# EAGLE design reverb2 (EAGLE 9.5.2)
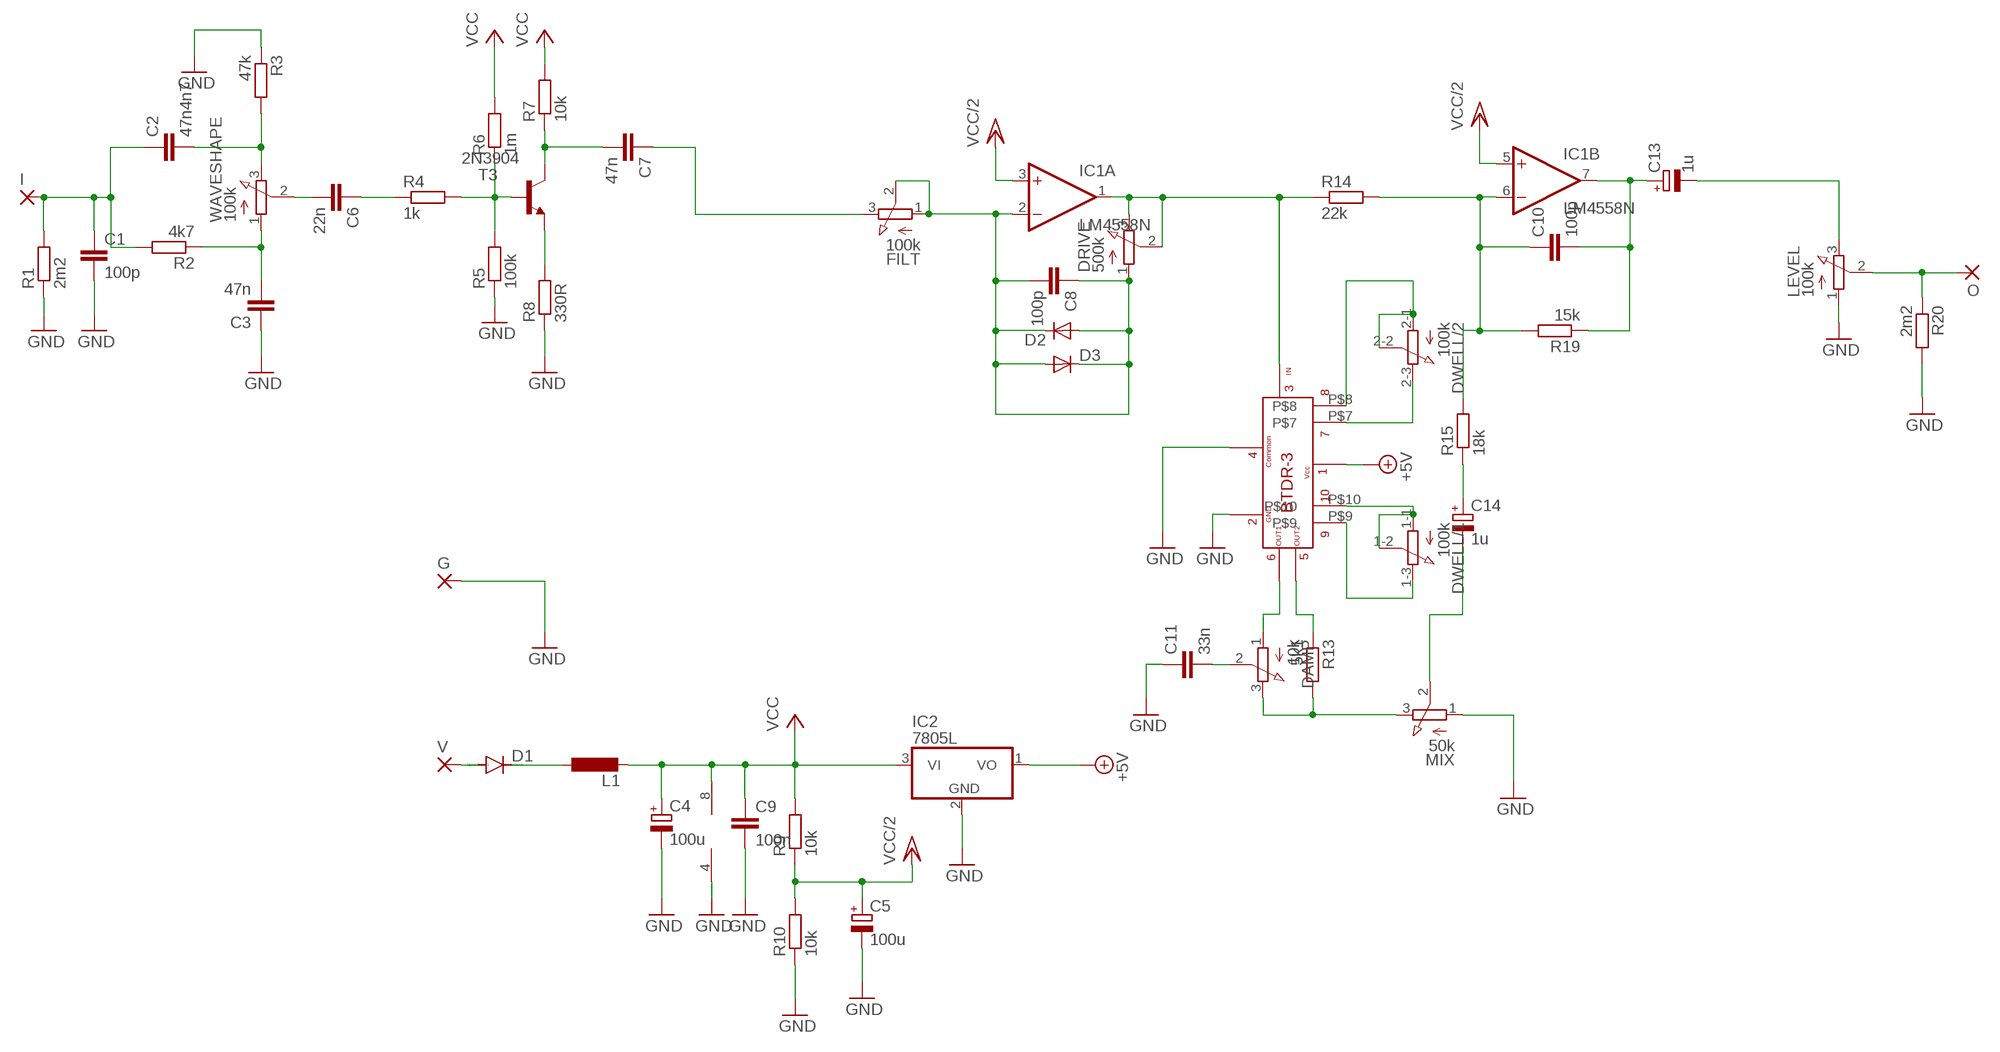
[diagram p0: schematic, sheet 1]

## Parts
C1  100p  C5/2.5  [S5MMHEXCAP]
C2  47n4n7  C5/2.5  [S5MMHEXCAP]
C3  47n  C5/2.5  [S5MMHEXCAP]
C4  100u  CPOL-EUE2.5-7  [E2,5-7]
C5  100u  CPOL-EUE2.5-7  [E2,5-7]
C6  22n  C5/2.5  [S5MMHEXCAP]
C7  47n  C5/2.5  [S5MMHEXCAP]
C8  100p  C5/2.5  [S5MMHEXCAP]
C9  100n  C5/2.5  [S5MMHEXCAP]
C10  100p  C5/2.5  [S5MMHEXCAP]
C11  33n  C5/2.5  [S5MMHEXCAP]
C13  1u  CPOL-EUE2-4  [E2-4]
C14  1u  CPOL-EUE2-4  [E2-4]
D1  1N4148DO35-7  [DO35-7]
D2  SMALL_DIODEDO35-7  [DO35-7]
D3  SMALL_DIODEDO35-7  [DO35-7]
DAMP  10k  HEXPOT1  [3RP/1610N]
DRIVE  500k  HEXPOT1  [3RP/1610N]
DWELL  100k  3RP/1610G  [3RP/1610G]
FILT  100k  HEXPOT1  [3RP/1610N]
G  WIREPAD1,6/0,9  [1,6/0,9]
I  WIREPAD1,6/0,9  [1,6/0,9]
IC1  LM4558N  [DIL08]
IC2  7805L  [TO92]
L1  L-EU0204/7  [0204/7]
LEVEL  100k  HEXPOT1  [3RP/1610N]
MIX  50k  HEXPOT1  [3RP/1610N]
O  WIREPAD1,6/0,9  [1,6/0,9]
R1  2m2  R-EU_0207/7  [0207/7]
R2  4k7  R-EU_0207/7  [0207/7]
R3  47k  R-EU_0207/7  [0207/7]
R4  1k  R-EU_0207/7  [0207/7]
R5  100k  R-EU_0207/7  [0207/7]
R6  1m  R-EU_0207/7  [0207/7]
R7  10k  R-EU_0207/7  [0207/7]
R8  330R  R-EU_0207/7  [0207/7]
R9  10k  R-EU_0207/7  [0207/7]
R10  10k  R-EU_0207/7  [0207/7]
R13  5k1  R-EU_0207/7  [0207/7]
R14  22k  R-EU_0207/7  [0207/7]
R15  18k  R-EU_0207/7  [0207/7]
R19  15k  R-EU_0207/7  [0207/7]
R20  2m2  R-EU_0207/7  [0207/7]
T3  2N3904  [TO92]
U$2  BTDR-3  [BTDR3]
V  WIREPAD1,6/0,9  [1,6/0,9]
WAVESHAPE  100k  HEXPOT1  [3RP/1610N]

## Nets
+5V: IC2.1(VO) U$2.P$1
GND: C1.2 C3.1 C4.- C5.- C9.2 C11.1 G.1(P) IC1.4(P:V-) IC2.2(GND) LEVEL.1(A) MIX.1(A) R1.1 R3.1 R5.1 R8.1 R10.1 R20.2 U$2.P$2 U$2.P$4
N$1: R4.2 R5.2 R6.1 T3.2(B)
N$2: C7.2 R7.1 T3.1(C)
N$3: DWELL.2-3(/2:E) U$2.P$7
N$4: R13.1 U$2.P$5
N$5: DAMP.1(A) U$2.P$6
N$6: C7.1 FILT.3(E)
N$7: DAMP.3(E) MIX.3(E) R13.2
N$8: D1.C L1.1
N$9: C2.2 R3.2 WAVESHAPE.3(E)
N$10: C13.- LEVEL.3(E)
N$11: C14.- MIX.2(S)
N$12: C11.2 DAMP.2(S)
N$13: C10.1 IC1.6(B:-IN) R14.2 R15.2 R19.2
N$14: C14.+ R15.1
N$15: C6.1 R4.1
N$16: C8.1 C8.2 D2.A D2.C D3.A D3.C DRIVE.1(A) FILT.1(A) FILT.2(S) IC1.2(A:-IN)
N$17: C3.2 R2.1 WAVESHAPE.1(A)
N$18: R8.2 T3.3(E)
N$19: C1.1 C2.1 I.1(P) R1.2 R2.2
N$20: C6.2 WAVESHAPE.2(S)
N$21: LEVEL.2(S) O.1(P) R20.1
N$22: D1.A V.1(P)
N$23: DRIVE.2(S) DRIVE.3(E) IC1.1(A:OUT) R14.1 U$2.P$3
N$24: C10.2 C13.+ IC1.7(B:OUT) R19.1
N$25: DWELL.2-1(/2:A) DWELL.2-2(/2:S) U$2.P$8
N$26: DWELL.1-3(/1:E) U$2.P$9
N$27: DWELL.1-1(/1:A) DWELL.1-2(/1:S) U$2.P$10
VCC: C4.+ C9.1 IC1.8(P:V+) IC2.3(VI) L1.2 R6.2 R7.2 R9.2
VCC/2: C5.+ IC1.3(A:+IN) IC1.5(B:+IN) R9.1 R10.2

## Library data of the parts
C1-C3 C6-C11 = hexcapacitor-wima:C: CAPACITOR naming: grid - package width
C4 C5 C13 C14 = hexresistor:CPOL-EU: POLARIZED CAPACITOR, European symbol; SPICEPREFIX: C
D1 = diode:1N4148: DIODE high speed (Philips)
D2 D3 = backside power header 10pin:SMALL_DIODE: Small Signal Diode
DAMP DRIVE FILT LEVEL MIX WAVESHAPE = hexpedalpot:HEXPOT1: 16mm Potentiometer one level Source: http://www.alphapotentiometers.net/html/16mm_pot_2.html
DWELL = hexpedalpot:3RP/1610G: 16mm Potentiometer two level Source: http://www.alphapotentiometers.net/html/16mm_pot_2.html
G I O V = wirepad:WIREPAD: Wire PAD connect wire on PCB
IC1 = linear:*4558: OP AMP
IC2 = linear:78*: Positive VOLTAGE REGULATOR Source: http://cache.national.com/ds/LM/LM78L05.pdf http://www.fairchildsemi.com/ds/LM/LM7805.pdf
L1 = hexresistor:L-EU: INDUCTOR, European symbol; SPICEPREFIX: L
R1-R10 R13-R15 R19 R20 = hexresistor:R-EU_: RESISTOR, European symbol; SPICEPREFIX: R
T3 = transistor:2N3904: NPN TRANSISTOR
U$2 = BTDR3:BTDR-3

## Net classes
0 default: width 0.356 mm

## Board
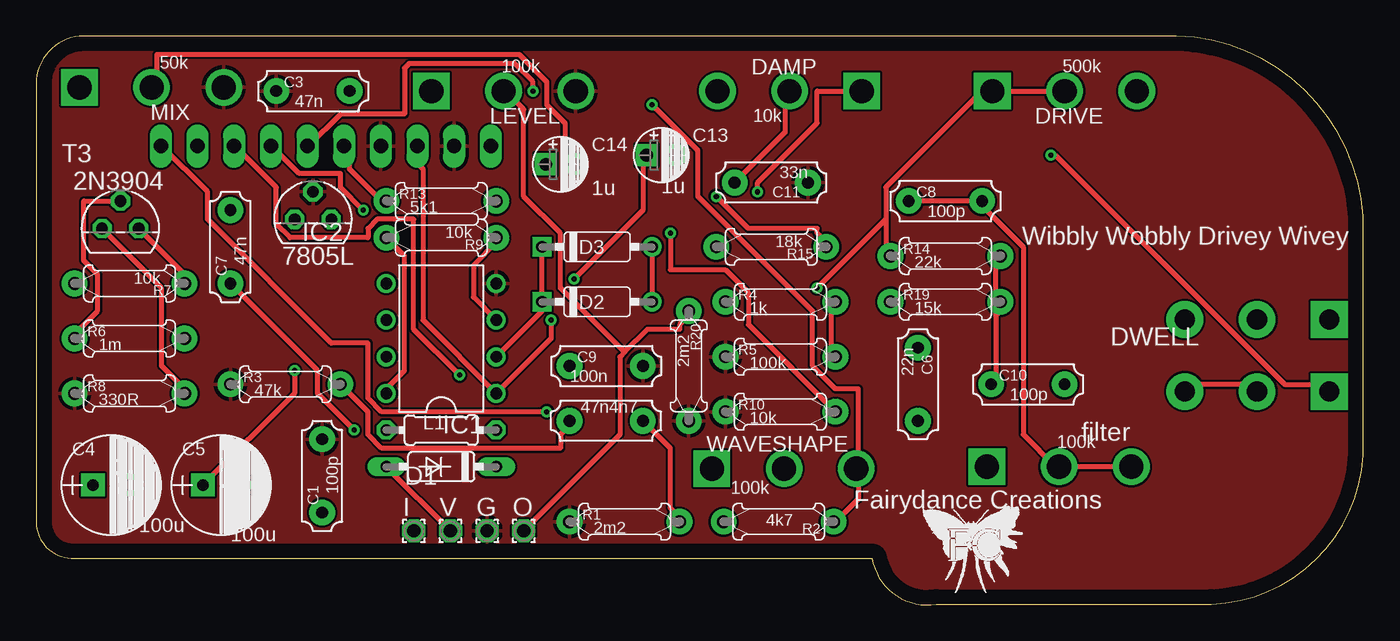
[diagram p1: board, top side]
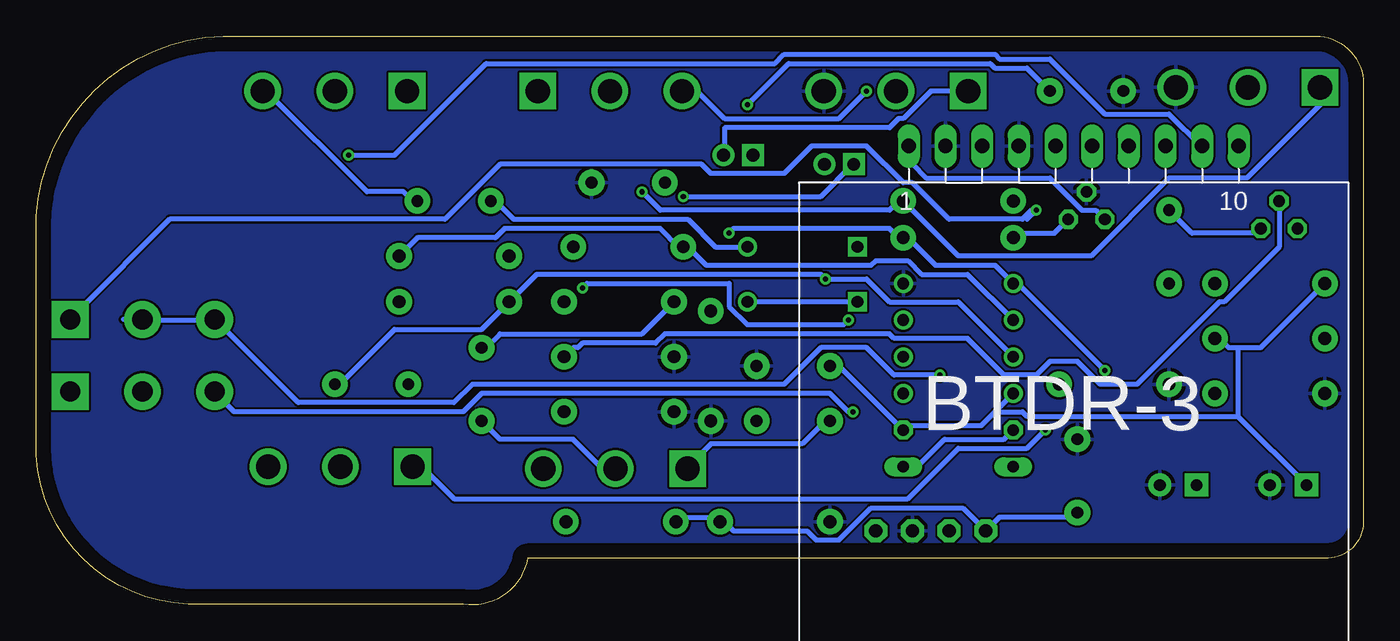
[diagram p2: board, bottom side, seen from below]

Size 91.95 x 39.42 mm. Coordinates in mm from the lower left corner, seen from the top.
Outline: 0,36.12 0,5.64 arc90 2.67,3.23 57.91,3.23 arc90 62.36,0.05 81.41,0.05 arc90 91.95,11.35 91.95,25.71 arc90 78.99,39.42 3.3,39.42 arc90 0,36.12
Copper layers (1*16): Top 0.035mm / dielectric 1.5mm / Bottom 0.035mm
Design rules "default": minimum track width 6mil, minimum drill 0.35mm, track to track 6mil, track to pad 6mil, pad to pad 6mil, via to via 6mil, smd to smd 6mil, copper to edge 40mil, drill to drill 6mil, minimum pad ring 10mil, minimum via ring 8mil, stop-mask expansion 4mil, vias tented up to drill 0mil, thermal gap 10mil

### Footprints (pad centres in the part's own frame; a part is rotated, then mirrored left to right if it is on the bottom)
S5MMHEXCAP = drill 0.813 pad 1.778: 1 -2.54,0; 2 2.54,0
E2,5-7 = drill 0.813 pad 1.6 square: + -1.27,0 | drill 0.813 pad 1.6: - 1.27,0
E2-4 = drill 0.889 pad 1.524 square: + -1.016,0 | drill 0.889 pad 1.524: - 1.016,0
DO35-7 = drill 0.813 long: A 3.81,0; C -3.81,0
DO35-7' = drill 0.813: A 3.81,0 | drill 0.813 square: C -3.81,0
3RP/1610N = drill 1.676 pad 2.54: 1 -5,0; 2 0,0 | drill 1.676 pad 2.54 square: 3 5,0
3RP/1610G = drill 1.397 pad 2.54: 1-1 -5,0; 1-2 0,0; 2-1 -5,5; 2-2 0,5 | drill 1.397 pad 2.54 square: 1-3 5,0; 2-3 5,5
1,6/0,9 = drill 0.914 pad 1.6 octagon: 1 0,0
DIL08 = drill 0.813 pad 1.27: 1 -3.81,-3.81; 2 -1.27,-3.81; 3 1.27,-3.81; 4 3.81,-3.81; 5 3.81,3.81; 6 1.27,3.81; 7 -1.27,3.81; 8 -3.81,3.81
TO92 = drill 0.813 octagon: 1 -1.27,0; 2 0,1.905; 3 1.27,0
0204/7 = drill 0.813 octagon: 1 -3.81,0; 2 3.81,0
0207/7 = drill 0.889 pad 1.778: 1 -3.81,0; 2 3.81,0
TO92' = drill 0.813 octagon: 1 1.27,0; 2 0,1.905; 3 -1.27,0
BTDR3 = drill 1 long: P$1 11.43,-9.525; P$2 8.89,-9.525; P$3 6.35,-9.525; P$4 3.81,-9.525; P$5 1.27,-9.525; P$6 -1.27,-9.525; P$7 -3.81,-9.525; P$8 -6.35,-9.525; P$9 -8.89,-9.525; P$10 -11.43,-9.525

### Placement (x,y rotation side)
C1  19.81,8.94 90 top
C2  39.5,12.75 180 top
C3  19.18,35.61 0 top
C4  5.21,8.31 0 top
C5  12.83,8.31 0 top
C6  61.09,15.29 270 top
C7  13.46,24.82 90 top
C8  62.99,27.99 0 top
C9  39.5,16.56 0 top
C10  68.71,15.29 0 top
C11  50.93,29.26 180 top
C13  43.31,31.17 0 top
C14  36.32,30.53 0 top
D1  28.07,9.58 180 top
D2  [DO35-7']  38.86,21.01 0 top
D3  [DO35-7']  38.86,24.82 0 top
DAMP  52.2,35.61 0 top
DRIVE  71.25,35.61 180 top
DWELL  84.58,14.78 0 top
FILT  70.87,9.58 180 top
G  31.24,5.13 0 top
I  26.16,5.13 0 top
IC1  28.07,18.47 90 top
IC2  19.18,26.72 0 top
L1  28.07,12.12 0 top
LEVEL  32.39,35.61 180 top
MIX  8,35.87 180 top
O  33.78,5.13 0 top
R1  40.77,5.77 0 top
R2  51.44,5.77 180 top
R3  17.27,15.29 0 top
R4  51.56,21.01 0 top
R5  51.56,17.2 0 top
R6  6.48,18.47 0 top
R7  6.48,22.28 180 top
R8  6.48,14.66 0 top
R9  28.07,25.45 180 top
R10  51.56,13.39 0 top
R13  28.07,27.99 0 top
R14  62.99,24.18 0 top
R15  50.93,24.82 180 top
R19  62.99,21.01 0 top
R20  45.21,16.56 270 top
T3  2N3904  [TO92']  5.84,26.09 0 top
U$2  20.07,22.28 180 bottom
V  28.7,5.13 0 top
WAVESHAPE  51.82,9.45 180 top

### Tracks (layer width: path | path; a pad name or v marks a point on that pad's centre or on a via)
+5V
  Bottom 0.356: IC2.1 18.54,27.36 19.49,27.36 21.72,29.58 30.29,29.58 31.24,30.53 31.24,31.8 U$2.P$1
GND
  pour Bottom: 0.76,36.88 0.76,5.77 arc90 7.11,-0.58 88.01,-0.58 arc90 102.17,13.58 arc90 74.42,41.33 5.21,41.33 arc90
  pour Top: 0.76,37.04 0.76,5.13 arc90 7.11,-1.22 82.04,-1.22 arc90 104.9,21.64 arc90 85.85,40.69 3.68,40.69 arc90
N$1
  Top 0.356: R5.2 55.05,17.51 55.05,20.69 R4.2 | T3.2 3.3,27.99 3.3,23.86 4.25,22.91 4.25,20.37 2.67,18.78 R6.1
  Bottom 0.356: R5.2 54.74,17.83 54.42,17.83 54.1,18.15 49.02,18.15 48.39,18.78 32.83,18.78 32.51,18.47 27.43,18.47 24.89,15.93 22.67,15.93 21.72,16.88 19.81,16.88 18.22,15.29 15.68,15.29 9.97,21.01 9.65,21.01 5.84,24.82 T3.2
N$2
  Top 0.356: T3.1 10.29,22.91 R7.1
  Bottom 0.356: C7.2 11.88,25.77 7.43,25.77 T3.1
N$3  (via drill 0.35)
  Top 0.356: v22.67,27.36 21.08,28.94 21.08,29.9 18.22,29.9 16.32,31.8 U$2.P$7
  Bottom 0.356: 23.3,26.72 v22.67,27.36 22.99,27.36 23.62,26.72 28.7,26.72 31.24,29.26 31.88,29.26 34.42,31.8 38.23,31.8 40.13,29.9 45.21,29.9 45.85,30.53 59.82,30.53 63.63,26.72 82.68,26.72 89.03,20.37 DWELL.2-3
N$4
  Top 0.356: R13.1 23.94,27.99 21.72,30.21 21.72,31.48 21.4,31.8 U$2.P$5
N$5  (via drill 0.35)
  Top 0.356: v34.42,35.61 34.42,36.25 33.15,37.52 25.84,37.52 25.53,37.2 25.53,34.02 21.08,34.02 18.86,31.8 U$2.P$6
  Bottom 0.356: v34.42,35.61 36.32,33.71 44.26,33.71 46.16,35.61 DAMP.1
N$6  (via drill 0.35)
  Top 0.356: C7.1 19.49,16.24 19.49,14.66 v22.03,12.12
  Bottom 0.356: v22.03,12.12 23.3,10.85 28.07,10.85 31.56,7.35 62.99,7.35 65.21,9.58 FILT.3
N$7  (via drill 0.35)
  Top 0.356: DAMP.3 54.1,35.61 54.1,33.39 49.97,29.26 v49.97,28.63
  Bottom 0.356: MIX.3 2.98,35.61 2.98,34.66 8.06,29.58 13.46,29.58 18.86,24.18 28.07,24.18 R13.2 32.2,27.99 32.83,27.36 48.71,27.36 v49.97,28.63
N$8
  Bottom 0.356: L1.1 24.89,11.48 29.02,11.48 30.92,9.58 D1.C
N$9
  Top 0.356: R3.2 22.99,13.39 22.99,11.8 23.94,10.85 36.32,10.85 36.32,11.8 36.96,12.43 C2.2
  Bottom 0.356: C2.2 37.28,12.75 38.86,11.16 45.21,11.16 46.8,9.58 WAVESHAPE.3
N$10
  Bottom 0.356: LEVEL.3 29.97,35.61 31.88,33.71 32.2,33.71 32.83,33.07 44.26,33.07 44.26,31.17 C13.-
N$11
  Top 0.356: MIX.2 8.38,36.25 8.38,38.15 33.46,38.15 35.37,36.25 35.37,34.66 36.64,33.39 36.64,31.17 37.28,30.53 C14.-
N$12
  Top 0.356: C11.2 51.88,32.75 51.88,35.29 DAMP.2
N$13
  Top 0.356: C10.1 66.48,15.61 66.48,20.05 | 66.48,20.05 66.8,20.37 R19.2 | R14.2 66.48,23.86 66.48,20.05
  Bottom 0.356: IC1.6 27.43,22.91 30.61,22.91 31.56,23.86 33.78,23.86 34.1,23.55 45.53,23.55 46.8,24.82 R15.2 47.43,24.82 48.71,26.09 59.5,26.09 60.14,25.45 65.53,25.45 R14.2
N$14  (via drill 0.35)
  Top 0.356: v47.12,28.31 49.34,26.09 54.1,26.09 54.1,25.77 54.74,25.13 R15.1
  Bottom 0.356: v47.12,28.31 37.59,28.31 35.37,30.53 C14.+
N$15
  Bottom 0.356: R4.1 49.97,18.78 59.82,18.78 60.77,17.83 C6.1
N$16
  Top 0.356: D3.A D2.A | IC1.2 35.05,20.37 D2.C D3.C | FILT.1 FILT.2 70.61,9.58 68.39,11.8 68.39,24.82 65.53,27.67 C8.2 C8.1
  Bottom 0.356: D2.C D2.A | C8.2 65.85,27.99 66.48,28.63 69.02,28.63 76.01,35.61 DRIVE.1 | D3.A 44.89,24.82 46.8,26.72 58.86,26.72 60.14,27.99 C8.1
N$17  (via drill 0.35)
  Top 0.356: v42.67,34.66 45.85,31.48 45.85,28.31 53.78,20.37 53.78,16.56 55.37,14.97 56.96,14.97 56.96,9.58 WAVESHAPE.1 56.96,9.26 56.96,7.35 55.37,5.77 R2.1
  Bottom 0.356: C3.2 23.3,37.2 25.53,37.2 25.84,37.52 39.82,37.52 v42.67,34.66
N$18
  Top 0.356: T3.3 8.7,21.96 8.7,16.56 10.29,14.97 R8.2
N$19
  Top 0.356: C2.1 43.94,10.85 43.94,6.72 44.58,6.08 R1.2
  Bottom 0.356: C1.1 20.13,6.08 25.21,6.08 I.1 27.75,6.72 34.1,6.72 36.32,4.5 37.91,4.5 38.54,5.13 43.62,5.13 44.26,5.77 R1.2 44.89,6.08 47.12,6.08 47.43,5.77 R2.2
N$20
  Bottom 0.356: C6.2 59.82,11.48 54.74,11.48 52.83,9.58 51.88,9.58 WAVESHAPE.2
N$21
  Top 0.356: O.1 40.45,11.8 40.45,17.2 40.77,17.51 | 40.77,17.51 42.35,19.1 44.58,19.1 44.58,19.42 45.21,20.05 R20.1 | 40.77,17.51 36.32,21.96 36.32,25.77 33.78,28.31 33.78,34.34 32.51,35.61 LEVEL.2
N$22
  Top 0.356: V.1 D1.A
N$23  (via drill 0.35)
  Top 0.356: U$2.P$3 26.48,31.8 26.48,30.53 26.8,30.21 26.8,19.74 IC1.1 35.69,18.47 v35.69,19.74 | R14.1 58.86,24.5 58.86,26.72 | 58.86,26.72 58.86,28.94 65.53,35.61 DRIVE.3 DRIVE.2 | 58.86,26.72 v54.1,21.96
  Bottom 0.356: v35.69,19.74 36,19.42 42.67,19.42 43.94,20.69 43.94,22.28 53.78,22.28 v54.1,21.96
N$24  (via drill 0.35)
  Top 0.356: v37.28,22.59 42.04,27.36 42.04,31.17 C13.+
  Bottom 0.356: C10.2 70.93,15.29 67.12,19.1 61.09,19.1 R19.1 57.28,22.91 37.59,22.91 v37.28,22.59 34.42,22.59 32.83,21.01 28.07,21.01 IC1.7
N$25  (via drill 0.35)
  Top 0.356: v29.34,15.93 26.16,19.1 26.16,26.72 23.62,26.72 22.99,26.09 22.99,25.45 17.59,25.45 16.64,26.4 16.64,28.94 13.78,31.8 U$2.P$8
  Bottom 0.356: 85.9,19.78 DWELL.2-2 84.58,19.74 | 84.58,19.42 84.58,19.74 | 84.58,19.74 80.14,19.74 DWELL.2-1 79.5,19.74 73.79,14.02 62.99,14.02 61.72,15.29 40.13,15.29 37.59,17.83 34.42,17.83 32.51,15.93 v29.34,15.93
N$26  (via drill 0.35)
  Top 0.356: DWELL.1-3 89.03,15.29 86.49,15.29 70.61,31.17 v70.3,31.17
  Bottom 0.356: v70.3,31.17 67.12,31.17 60.77,37.52 40.77,37.52 40.13,38.15 25.53,38.15 25.21,37.83 21.72,37.83 17.91,34.02 13.46,34.02 11.24,31.8 U$2.P$9
N$27  (via drill 0.35)
  Top 0.356: v35.37,13.39 23.94,13.39 22.99,14.34 22.99,18.15 20.45,18.15 11.88,26.72 11.88,28.63 8.7,31.8 U$2.P$10 | 84.58,14.97 DWELL.1-2 84.58,15.29 80.14,15.29 DWELL.1-1 79.82,14.97
  Bottom 0.356: DWELL.1-1 79.5,14.66 78.23,13.39 62.36,13.39 61.09,14.66 36.96,14.66 35.69,13.39 v35.37,13.39
VCC
  Top 0.356: R9.2 25.53,24.18 25.53,16.24 24.26,14.97 IC1.8
  Bottom 0.356: 8.7,13.07 C4.+ | 8.7,17.83 8.7,13.07 | 8.7,17.83 9.33,17.83 9.97,18.47 R6.2 | R7.2 7.11,17.83 8.7,17.83 | IC2.3 21.4,25.77 23.94,25.77 R9.2 | 32.2,12.43 36.32,16.56 C9.1 | 25.53,13.39 26.48,12.43 32.2,12.43 | 25.53,13.39 IC1.8 | 32.2,12.43 L1.2 | 8.7,13.07 23.3,13.07 23.62,13.39 25.53,13.39
VCC/2  (via drill 0.35)
  Top 0.356: IC1.3 30.29,21.32 30.29,23.55 31.88,25.13 R9.1 | C5.+ 17.91,14.66 v17.91,16.24 | R10.2 49.34,19.42 49.34,21.64 47.75,23.23 43.94,23.23 v43.94,25.77
  Bottom 0.356: v17.91,16.24 23.94,22.28 IC1.5 25.53,23.55 29.65,23.55 31.56,25.45 R9.1 32.2,25.45 32.83,26.09 43.62,26.09 v43.94,25.77

### Text on the board
tNames: Wibbly Wobbly Drivey Wivey | filter | Fairydance Creations